# EAGLE design Reverse Geocache schematic v0.2 (EAGLE 5.11)
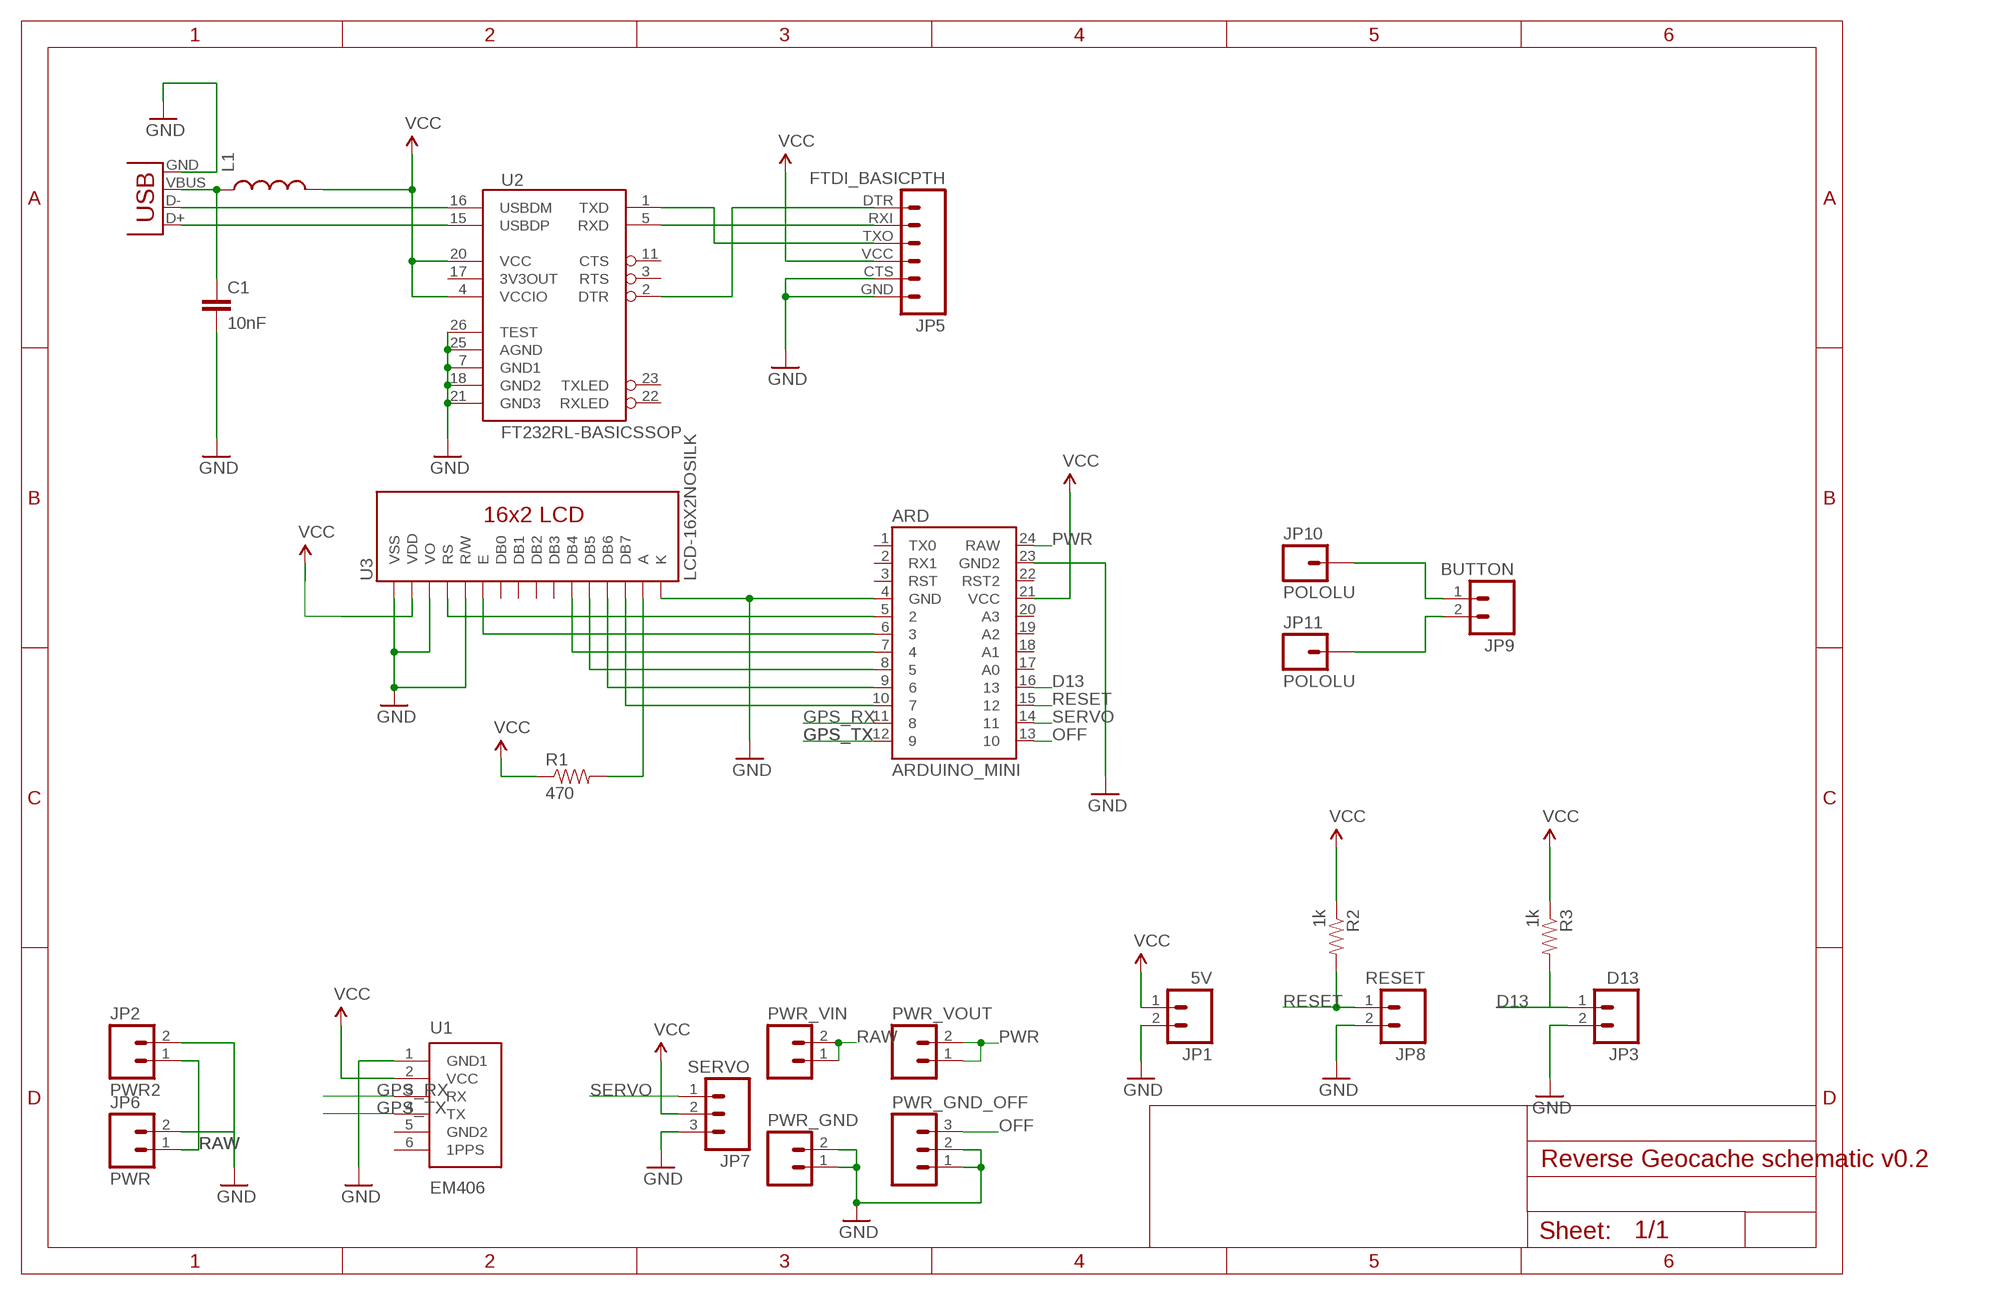
[diagram p0: schematic, sheet 1]

## Parts
ARD  ARDUINO_MINI  [ARDUINO_MINI]
C1  10nF  CAP0603-CAP  [0603-CAP]
JP1  5V  M02PTH  [1X02]
JP2  PWR2  M02PTH  [1X02]
JP3  D13  M02PTH  [1X02]
JP5  FTDI_BASICPTH  [FTDI_BASIC]
JP6  PWR  M02POLAR  [MOLEX-1X2]
JP7  SERVO  M03PTH  [1X03]
JP8  RESET  M02PTH  [1X02]
JP9  BUTTON  M02PTH  [1X02]
JP10  POLOLU  M01PTH  [1X01]
JP11  POLOLU  M01PTH  [1X01]
L1  INDUCTOR0603  [0603]
PWR_GND  M02PTH  [1X02]
PWR_GND_OFF  M03PTH  [1X03]
PWR_VIN  M02PTH  [1X02]
PWR_VOUT  M02PTH  [1X02]
R1  470  RESISTORPTH-1/4W  [AXIAL-0.4]
R2  1k  RESISTORPTH-1/4W  [AXIAL-0.4]
R3  1k  RESISTORPTH-1/4W  [AXIAL-0.4]
U1  EM406  [EM406]
U2  FT232RL-BASICSSOP  [SSOP28DB]
U3  LCD-16X2NOSILK  [LCD-16X2_NOSILK]
X1  USBPTH-VERTICAL  [USB-B-PTH-VERTICAL]

## Nets
D13: ARD.16 JP3.1 R3.P$2
GPS_RX: ARD.11 U1.3(RX)
GPS_TX: ARD.12 U1.4(TX)
N$1: U2.16(USBDM) X1.D-
N$2: U2.15(USBDP) X1.D+
N$3: C1.1 L1.1 X1.VBUS
N$4: ARD.5 U3.4(RS)
N$5: JP5.TXO U2.1(TXD)
N$6: JP5.RXI U2.5(RXD)
N$8: JP5.DTR U2.2(DTR)
N$10: R1.P$2 U3.15(A)
N$12: ARD.6 U3.6(E)
N$13: ARD.7 U3.11(DB4)
N$14: ARD.8 U3.12(DB5)
N$15: ARD.9 U3.13(DB6)
N$16: ARD.10 U3.14(DB7)
N$19: ARD.4(GND) ARD.23(GND2) C1.2 JP1.2 JP2.2 JP3.2 JP5.CTS JP5.GND JP6.2 JP7.3 JP8.2 PWR_GND.1 PWR_GND.2 PWR_GND_OFF.1 PWR_GND_OFF.2 U1.1(GND1) U2.7(GND1) U2.18(GND2) U2.21(GND3) U2.25(AGND) U2.26(TEST) U3.1(VSS) U3.3(VO) U3.5(R/W) U3.16(K) X1.GND ; supply symbol labelled GND
N$20: JP9.1 JP10.1
N$21: JP9.2 JP11.1
OFF: ARD.13 PWR_GND_OFF.3
PWR: ARD.24(RAW) PWR_VOUT.1 PWR_VOUT.2
RAW: JP2.1 JP6.1 PWR_VIN.1 PWR_VIN.2
RESET: ARD.15 JP8.1 R2.P$2
SERVO: ARD.14 JP7.1
VCC: ARD.21(VCC) JP1.1 JP5.VCC JP7.2 L1.2 R1.P$1 R2.P$1 R3.P$1 U1.2(VCC) U2.4(VCCIO) U2.20(VCC) U3.2(VDD)
Unconnected: ARD.1(TX0) ARD.2(RX1) ARD.3(RST) ARD.17(A0) ARD.18(A1) ARD.19(A2) ARD.20(A3) ARD.22(RST2) U1.5(GND2) U1.6(1PPS) U2.3(RTS) U2.11(CTS) U2.17(3V3OUT) U2.22(RXLED) U2.23(TXLED) U3.7(DB0) U3.8(DB1) U3.9(DB2) U3.10(DB3)

## Library data of the parts
ARD = SparkFun:ARDUINO_MINI
C1 = SparkFun:CAP: Capacitor Standard 0603 ceramic capacitor, and 0.1" leaded capacitor.
JP1-JP3 JP6 JP8 JP9 PWR_GND PWR_VIN PWR_VOUT = SparkFun:M02: Header 2 Standard 2-pin 0.1" header. Use with straight break away headers (SKU : PRT-00116), right angle break away headers (PRT-00553), swiss pins (PRT-00743), machine pins (PRT-00117), and female headers (PRT-00115). Molex polarized connector foot print use with SKU : PRT-08233 with associated crimp pins and housings.
JP5 = SparkFun:FTDI_BASIC: FTDI Basic: 3.3V and 5V
JP7 PWR_GND_OFF = SparkFun:M03: Header 3 Standard 3-pin 0.1" header. Use with straight break away headers (SKU : PRT-00116), right angle break away headers (PRT-00553), swiss pins (PRT-00743), machine pins (PRT-00117), and female headers (PRT-00115). Molex polarized connector foot print use with SKU : PRT-08232 with associated crimp pins and housings.
JP10 JP11 = SparkFun:M01: Header 1 Standard 1-pin 0.1" header. Use with straight break away headers (SKU : PRT-00116), right angle break away headers (PRT-00553), swiss pins (PRT-00743), machine pins (PRT-00117), and female headers (PRT-00115).
L1 = SparkFun:INDUCTOR: Inductors Basic Inductor/Choke - 0603 and 1206. Footprints are not proven and vary greatly between part numbers.
R1-R3 = SparkFun:RESISTOR: Resistor Basic schematic elements and footprints for 0603, 1206, and PTH resistors.
U1 = SparkFun:EM406: EM406 Connector Proven layout and schematic for EM406 connector. Spark Fun Electronics SKU : GPS-00579
U2 = SparkFun:FT232RL-BASIC: USB UART This is the simplified version of the FT232RL unit. Only what you need, nothing you don't. Spark Fun Electronics SKU : COM-00650
U3 = SparkFun:LCD-16X2
X1 = SparkFun:USB: USB Connectors USB-B-PTH is fully proven SKU : PRT-00139 USB-miniB is fully proven SKU : PRT-00587 USB-A-PCB is untested. USB-A-H is throughly reviewed, but untested. Spark Fun Electronics SKU : PRT-00437 USB-B-SMT is throughly reviewed, but untested. Needs silkscreen touching up. USB-A-S has not been used/tested USB-MB-H has not been used/tested

## Board
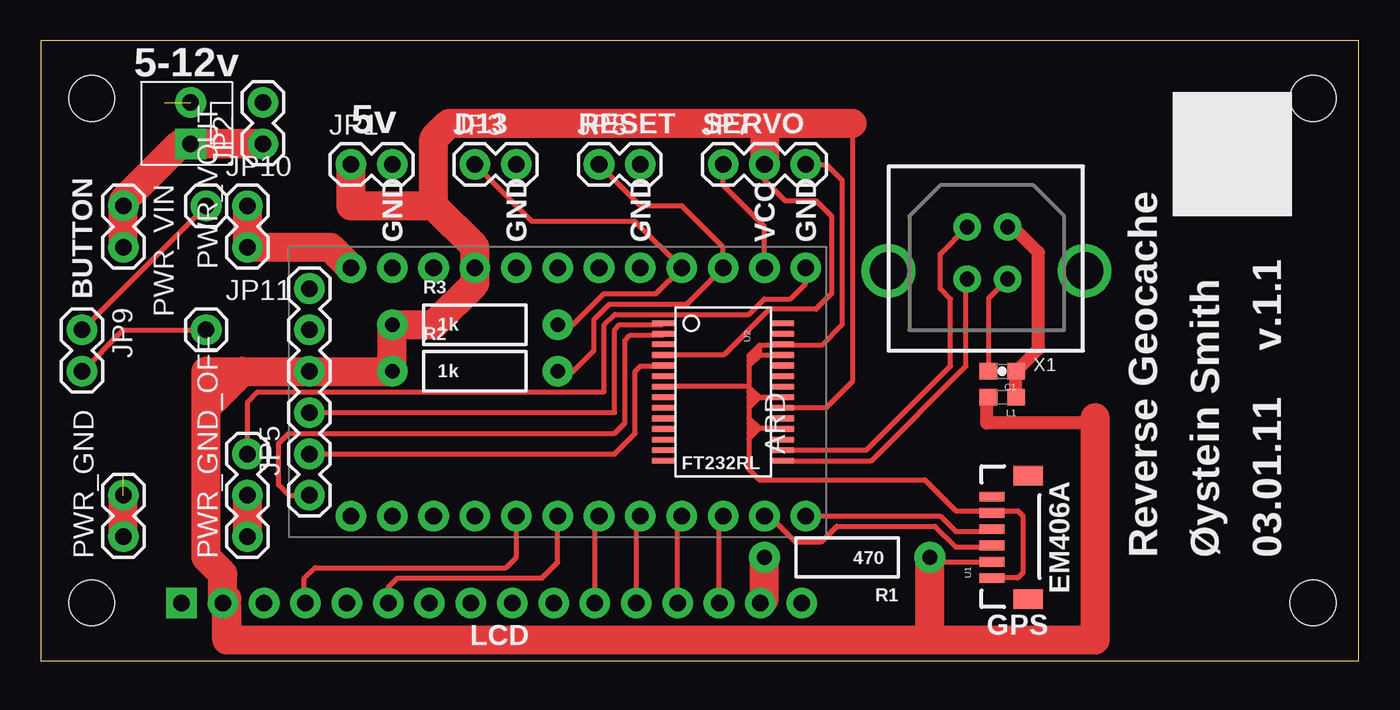
[diagram p1: board, top side]
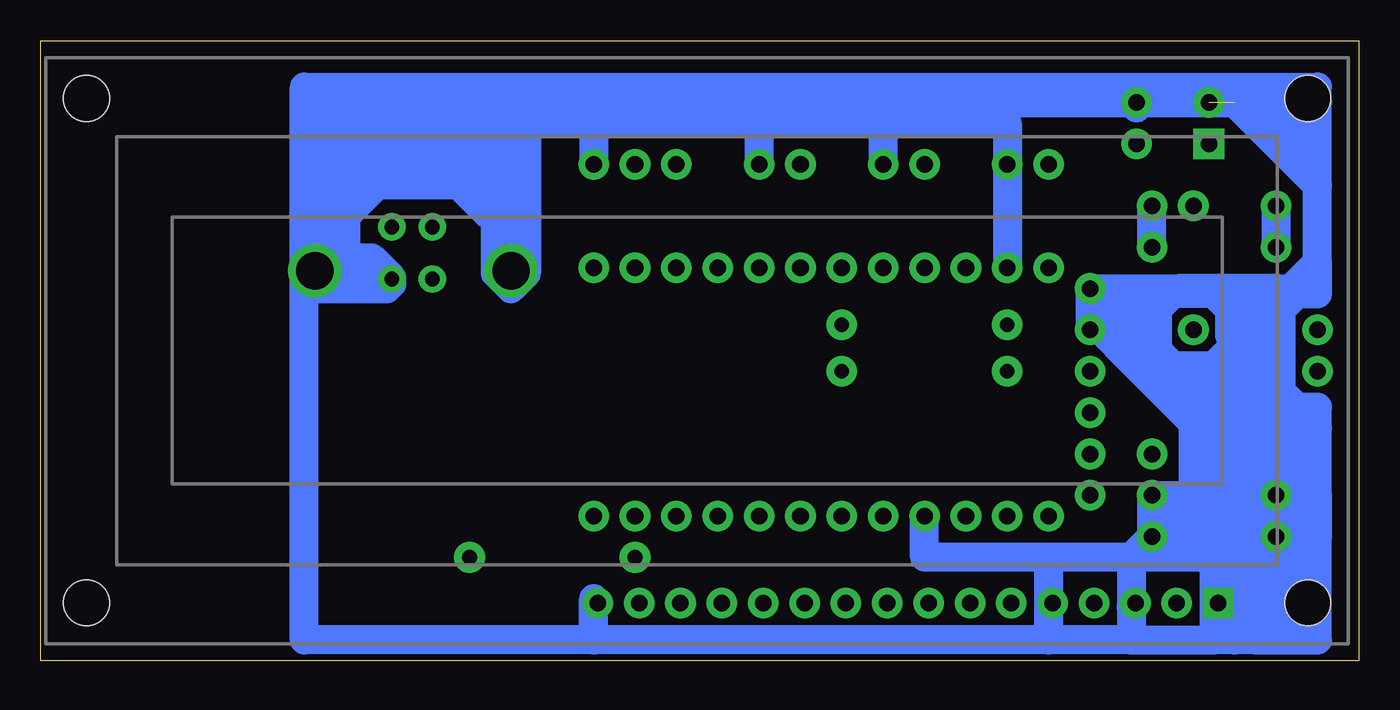
[diagram p2: board, bottom side, seen from below]

Size 80.95 x 38.09 mm. Coordinates in mm from the lower left corner, seen from the top.
Outline: 0,0 80.95,0 80.95,38.09 0,38.09 0,0
Copper layers (1*16): Top 0.035mm / dielectric 1.5mm / Bottom 0.035mm
Design rules "default": minimum track width 10mil, minimum drill 24mil, track to track 8mil, track to pad 8mil, pad to pad 8mil, via to via 8mil, smd to smd 8mil, copper to edge 40mil, drill to drill 8mil, minimum pad ring 10mil, minimum via ring 8mil, stop-mask expansion 4mil, vias tented up to drill 0mil, thermal gap 10mil

### Footprints (pad centres in the part's own frame; a part is rotated, then mirrored left to right if it is on the bottom)
ARDUINO_MINI = drill 1.016 pad 1.88 round: 1 -7.62,12.7; 2 -7.62,10.16; 3 -7.62,7.62; 4 -7.62,5.08; 5 -7.62,2.54; 6 -7.62,0; 7 -7.62,-2.54; 8 -7.62,-5.08; 9 -7.62,-7.62; 10 -7.62,-10.16; 11 -7.62,-12.7; 12 -7.62,-15.24; 13 7.62,-15.24; 14 7.62,-12.7; 15 7.62,-10.16; 16 7.62,-7.62; 17 7.62,-5.08; 18 7.62,-2.54; 19 7.62,0; 20 7.62,2.54; 21 7.62,5.08; 22 7.62,7.62; 23 7.62,10.16; 24 7.62,12.7
0603-CAP = smd 1.1 x 1: 1 -0.85,0; 2 0.85,0
1X02 = drill 1.016 pad 1.88 round: 1 0,0; 2 2.54,0
FTDI_BASIC = drill 1.016 pad 1.88 round: CTS 10.16,0; DTR 0,0; GND 12.7,0; RXI 2.54,0; TXO 5.08,0; VCC 7.62,0
MOLEX-1X2 = drill 1.016 pad 1.88 square: 1 0,0 | drill 1.016 pad 1.88 round: 2 2.54,0
1X03 = drill 1.016 pad 1.88 round: 1 0,0; 2 2.54,0; 3 5.08,0
1X01 = drill 1.016 pad 1.88 round: 1 0,0
0603 = smd 1.1 x 1: 1 -0.85,0; 2 0.85,0
AXIAL-0.4 = drill 0.9 pad 1.88 round: P$1 -5.08,0; P$2 5.08,0
EM406 = smd 0.6 x 1.55: 1 0,0; 2 1,0; 3 2,0; 4 3,0; 5 4,0; 6 5,0 | smd 1.2 x 1.8: P$1 -1.3,-2.225; P$2 6.3,-2.225
SSOP28DB = smd 0.348 x 1.397: 1 -4.225,-3.656; 2 -3.575,-3.656; 3 -2.925,-3.656; 4 -2.275,-3.656; 5 -1.625,-3.656; 6 -0.975,-3.656; 7 -0.325,-3.656; 8 0.325,-3.656; 9 0.975,-3.656; 10 1.625,-3.656; 11 2.275,-3.656; 12 2.925,-3.656; 13 3.575,-3.656; 14 4.225,-3.656; 15 4.225,3.656; 16 3.575,3.656; 17 2.925,3.656; 18 2.275,3.656; 19 1.625,3.656; 20 0.975,3.656; 21 0.325,3.656; 22 -0.325,3.656; 23 -0.975,3.656; 24 -1.625,3.656; 25 -2.275,3.656; 26 -2.925,3.656; 27 -3.575,3.656; 28 -4.225,3.656
LCD-16X2_NOSILK = drill 1.016 pad 1.88 square: 1 -32,15.5 | drill 1.016 pad 1.88 round: 2 -29.46,15.5; 3 -26.92,15.5; 4 -24.38,15.5; 5 -21.84,15.5; 6 -19.3,15.5; 7 -16.76,15.5; 8 -14.22,15.5; 9 -11.68,15.5; 10 -9.14,15.5; 11 -6.6,15.5; 12 -4.06,15.5; 13 -1.52,15.5; 14 1.02,15.5; 15 3.56,15.5; 16 6.1,15.5 | hole 2.8: -37.5,15.5; -37.5,-15.5; 37.5,15.5; 37.5,-15.5
USB-B-PTH-VERTICAL = drill 0.914 pad 1.676 round: D+ 4.826,4.394; D- 4.826,7.595; GND 7.315,4.394; VBUS 7.315,7.595 | drill 2.286 round: P$1 0,4.902; P$2 12.04,4.902

### Placement (x,y rotation side)
ARD  31.75,16.51 90 top
C1  59.05,17.78 180 top
JP1  19.05,30.48 0 top
JP2  13.65,31.75 90 top
JP3  26.67,30.48 0 top
JP5  16.51,10.16 90 top
JP6  9.21,31.75 90 top
JP7  41.91,30.48 0 top
JP8  34.29,30.48 0 top
JP9  2.54,20.32 270 top
JP10  10.16,27.94 0 top
JP11  10.16,20.32 0 top
L1  59.05,16.19 180 top
PWR_GND  5.08,7.62 90 top
PWR_GND_OFF  12.7,7.62 90 top
PWR_VIN  5.08,27.94 270 top
PWR_VOUT  12.7,25.4 90 top
R1  49.53,6.35 180 top
R2  26.67,17.78 0 top
R3  26.67,20.64 0 top
U1  58.42,5.08 90 top
U2  41.91,16.51 270 top
U3  40.64,19.05 180 bottom
X1  52.07,19.05 0 top

### Tracks (layer width: path | path; a pad name or v marks a point on that pad's centre or on a via)
D13
  Top 0.305: JP3.1 30.16,26.99 36.51,26.99 ARD.16 37.78,22.54 34.61,22.54 32.7,20.64 R3.P$2
GPS_RX
  Top 0.305: ARD.11 44.77,8.89 46.35,7.3 47.94,7.3 48.9,8.26 54.93,8.26 56.2,6.98 58.33,6.98 U1.3
GPS_TX
  Top 0.305: ARD.12 55.24,8.89 56.2,7.94 58.28,7.94 U1.4
N$1
  Top 0.305: U2.16 50.72,12.93 55.88,18.1 55.88,22.22 55.24,22.86 55.24,24.99 X1.D-
N$2
  Top 0.305: U2.15 51.02,12.29 56.83,18.1 56.83,23.38 X1.D+
N$3
  Top 0.813: L1.1 C1.1 61.28,19.15 61.28,25.08 59.72,26.64 X1.VBUS
N$4
  Top 0.305: ARD.5 29.21,6.35 28.57,5.71 16.83,5.71 16.19,5.08 16.19,3.62 U3.4
N$5
  Top 0.305: JP5.TXO 35.24,15.24 35.24,20.32 35.56,20.64 38.16,20.64 U2.1
N$6
  Top 0.305: JP5.RXI 35.24,12.7 36.51,13.97 36.51,17.78 36.83,18.1 38.22,18.1 U2.5
N$8
  Top 0.305: JP5.DTR 15.24,10.16 14.61,10.79 14.61,13.33 15.24,13.97 35.24,13.97 35.88,14.61 35.88,19.68 36.2,20 38.17,20 U2.2
N$10
  Top 1.778: R1.P$2 44.45,3.8 U3.15
N$11
  Bottom 1.778: 62.23,24.77 60.64,24.77 59.37,23.5 | 62.23,24.77 64.45,24.77 | 62.23,24.77 62.23,27.3 60.33,29.21 55.24,29.21 53.34,27.3 53.34,29.21 54.93,30.8 60.96,30.8 63.82,27.94 | 63.82,27.94 63.82,25.4 | 63.82,27.94 63.82,31.75 54.29,31.75 53.98,31.43 61.91,31.43 62.87,30.48
N$12
  Top 0.305: U3.6 21.34,4.51 21.91,5.08 30.8,5.08 31.75,6.03 ARD.6
N$13
  Top 0.305: U3.11 34.04,8.64 ARD.7
N$14
  Top 0.305: U3.12 36.58,8.64 ARD.8
N$15
  Top 0.305: U3.13 39.12,8.64 ARD.9
N$16
  Top 0.305: U3.14 41.66,8.64 ARD.10
N$17
  Top 1.778: 11.43,3.81 11.43,1.27 64.77,1.27 64.77,14.92
N$18
  Bottom 1.778: 4.13,12.06 4.13,14.29
N$19  (2 unrouted)
  Top 0.305: U2.7 43.49,16.84 43.5,16.83 | 43.5,18.1 43.5,16.83 | 43.5,18.41 43.5,18.73 43.55,18.79 | 44.13,19.37 43.55,18.79 | 45.5,19.37 44.13,19.37 | 45.5,19.37 U2.26 | 43.55,18.79 U2.25 | 43.5,16.83 44.13,16.19 | 44.13,16.19 45.56,16.19 U2.21 44.14,16.18 44.13,16.19 | 44.13,16.19 43.81,15.88 | 43.81,15.88 43.5,15.56 | 43.5,15.56 43.5,14.92 | 43.5,14.92 44.13,14.29 | 44.13,14.29 45.51,14.29 U2.18 | 43.5,16.19 43.5,15.56 | 43.5,16.51 43.5,16.19 | 43.5,16.83 43.5,16.51 | 43.5,16.51 43.81,16.19 | 43.5,16.19 43.81,15.88 | 44.13,18.73 43.5,18.1 | 43.5,18.41 43.5,18.1 | 43.81,18.73 43.5,18.41 | 44.13,18.73 43.81,18.73 | 44.13,19.05 44.13,18.73 | 44.13,19.37 44.13,19.05 | 44.13,19.05 43.81,18.73 | 45.5,19.37 47.94,19.37 49.21,20.64 49.21,29.53 48.26,30.48 JP7.3 | 43.5,14.92 43.5,14.61 | 43.5,14.61 43.5,13.97 | 43.5,13.65 43.5,11.75 44.13,11.11 54.29,11.11 56.2,9.21 60.01,9.21 60.33,8.89 60.33,5.4 60.01,5.08 U1.1 | 44.13,14.29 43.5,13.65 | 43.5,13.97 43.5,13.65 | 43.5,13.97 43.81,14.29 43.5,14.61 | C1.2 58.2,22.26 X1.GND
  Top 1.778: PWR_GND.1 PWR_GND.2 | PWR_GND_OFF.1 PWR_GND_OFF.2
  Bottom 1.778: 10.16,18.1 10.16,10.48 8.89,10.48 8.89,18.1 7.3,19.68 7.3,20.95 9.21,22.86 | 2.54,7.62 2.54,1.27 6.35,1.27 | 2.54,8.89 2.54,7.62 | 7.62,1.27 8.89,1.27 | 13.97,1.27 19.05,1.27 | 19.05,1.27 46.99,1.27 | 46.99,1.27 46.99,3.81 U3.16 | 46.99,1.27 64.77,1.27 64.77,22.86 | 64.77,24.13 64.77,33.02 | 64.77,22.86 64.77,24.13 | 64.77,33.02 64.77,34.29 | 29.21,34.29 7.62,34.29 | 2.54,34.29 6.35,34.29 | 64.77,34.29 29.21,34.29 | 64.77,33.02 52.07,33.02 | 52.07,33.02 51.12,33.02 | 51.12,33.02 46.99,33.02 | 36.83,33.02 21.59,33.02 JP1.2 ARD.23 | 46.99,33.02 36.83,33.02 | 46.99,33.02 JP7.3 | 64.77,24.13 60.96,24.13 59.69,22.86 | 64.77,22.86 59.69,22.86 | 7.62,7.62 2.54,7.62 | PWR_GND_OFF.1 8.89,7.62 | 12.7,8.89 PWR_GND_OFF.2 2.54,10.16 | 2.54,10.16 2.54,8.89 | 12.7,8.89 2.54,8.89 | PWR_GND_OFF.1 12.7,8.89 | 13.97,6.35 PWR_GND_OFF.1 | 13.97,6.35 13.97,3.3 | 13.97,1.27 8.89,1.27 | 8.89,7.62 8.89,3.3 | 8.89,7.62 7.62,7.62 | 7.62,1.27 7.62,7.62 | 6.35,1.27 7.62,1.27 | 6.35,1.27 6.35,6.35 5.08,6.35 5.08,2.54 3.81,2.54 3.81,6.35 13.97,6.35 | ARD.4 26.67,6.35 19.05,6.35 | 19.05,3.81 19.05,1.27 | 19.05,6.35 19.05,3.81 | 8.89,3.3 8.89,1.27 | 8.89,3.3 U3.1 | 13.97,3.3 13.97,1.27 | 13.97,3.3 U3.3 | U3.5 19.05,3.81 | JP5.GND JP5.CTS 15.24,20.32 16.51,21.59 JP5.GND | 7.62,19.05 7.62,11.43 6.35,11.43 6.35,19.05 5.08,19.05 | 5.08,16.83 5.08,19.05 | 5.08,16.83 5.08,11.43 3.81,11.43 | X1.GND 59.38,23.16 59.69,22.86 | 13.97,6.35 19.05,6.35 | 13.65,33.97 JP2.2 JP6.2 | 36.83,33.02 36.83,33.66 | 36.83,33.02 JP8.2 | 29.21,34.29 JP3.2 | 52.07,24.77 52.07,23.81 | 52.07,33.02 52.07,24.77 | 52.07,24.77 53.02,23.81 | 53.02,23.81 53.02,25.72 | 53.02,25.72 53.02,32.7 | 51.12,23.81 53.02,25.72 | 51.12,33.02 51.12,23.81
  Bottom 1.778: 51.12,23.81 52.07,22.86 53.02,23.81 | 2.54,10.16 2.54,14.29 | 2.54,14.29 5.08,16.83 | 5.08,19.05 5.08,22.54 | 5.08,22.54 16.19,22.54 JP5.GND | 5.08,22.86 9.21,22.86 | JP5.GND 11.11,22.86 | 5.08,22.54 5.08,22.86 | 6.03,20 7.94,20 7.94,21.27 6.35,21.27 5.08,22.54 | 9.21,22.86 11.11,22.86 | 11.11,22.86 13.02,20.95 13.02,21.59 12.38,22.22 12.38,19.05 11.11,17.78 8.57,17.78 8.26,18.1 13.65,18.1 | 13.65,18.1 16.19,20.64 | 13.65,18.1 9.84,14.29 9.84,15.56 14.29,20 14.29,21.27 14.61,21.59 | 5.08,22.86 2.54,22.86 | 2.54,24.45 2.54,22.86 | 2.54,29.21 2.54,34.29 | 2.54,14.29 2.54,15.56 4.76,15.56 4.76,21.59 3.81,22.54 2.54,22.54 2.54,22.86 | 2.54,24.45 4.45,22.54 5.08,22.54 | 2.54,24.45 2.54,29.21 | 2.54,29.21 7.62,34.29 | 7.62,34.29 6.35,34.29 | 6.35,34.29 3.49,31.43 3.49,33.02 3.81,33.34 | 2.54,34.29 2.54,35.24 64.77,35.24 64.77,34.29
N$20
  Top 0.305: JP9.1 JP10.1
N$21
  Top 0.305: JP9.2 5.08,20.32 JP11.1
OFF
  Top 0.305: PWR_GND_OFF.3 12.7,15.88 13.34,16.51 34.61,16.51 34.61,20.64 35.24,21.27 43.5,21.27 44.45,22.22 46.04,22.22 46.99,23.18 ARD.13
PWR
  Top 1.778: ARD.24 17.78,25.4 PWR_VOUT.1 PWR_VOUT.2
  Bottom 1.778: PWR_VOUT.1 PWR_VOUT.2
RAW
  Top 1.778: JP6.1 JP2.1 8.57,31.75 5.08,28.26 PWR_VIN.1 PWR_VIN.2
  Bottom 1.778: PWR_VIN.2 PWR_VIN.1
RESET
  Top 0.305: JP8.1 36.83,27.94 39.37,27.94 41.91,25.4 ARD.15 39.69,21.91 34.92,21.91 33.97,20.95 33.97,19.05 32.7,17.78 R2.P$2
SERVO
  Top 0.305: JP7.1 41.91,29.21 44.45,26.67 ARD.14
VCC
  Top 0.305: JP7.2 44.45,29.53 45.72,28.26 47.62,28.26 48.58,27.3 48.58,22.54 47.62,21.59 44.77,21.59 41.96,18.79 U2.4 | U1.2 54.88,6.08 R1.P$1 | 64.77,14.61 64.77,13.33 | U2.20 48.24,15.54 49.85,17.14 49.85,33.02
  Top 0.813: 64.77,14.61 58.1,14.61 58.1,16.09 L1.2
  Top 1.778: 12.38,17.78 10.16,17.78 10.16,15.56 | 12.38,17.78 JP5.VCC R2.P$1 R3.P$1 24.13,20.64 26.67,23.18 ARD.21 26.67,25.4 24.13,27.94 | 10.16,15.56 10.16,6.35 11.18,5.33 U3.2 11.43,3.3 11.43,1.27 54.61,1.27 | 54.61,1.27 R1.P$1 | 44.45,33.02 JP7.2 | 44.45,33.02 49.85,33.02 | 10.16,15.56 12.38,17.78 | JP1.1 19.05,27.94 24.13,27.94 | 24.13,27.94 24.13,32.07 25.08,33.02 44.45,33.02 | 64.77,14.61 64.77,1.27 54.61,1.27

### Text on the board
tPlace: 5-12v | 5v | D13 | RESET | SERVO | GND | GND | GND | VCC | GND | BUTTON | v.1.1 | FT232RL | Reverse Geocache | Øystein Smith | 03.01.11 | EM406A | LCD | GPS